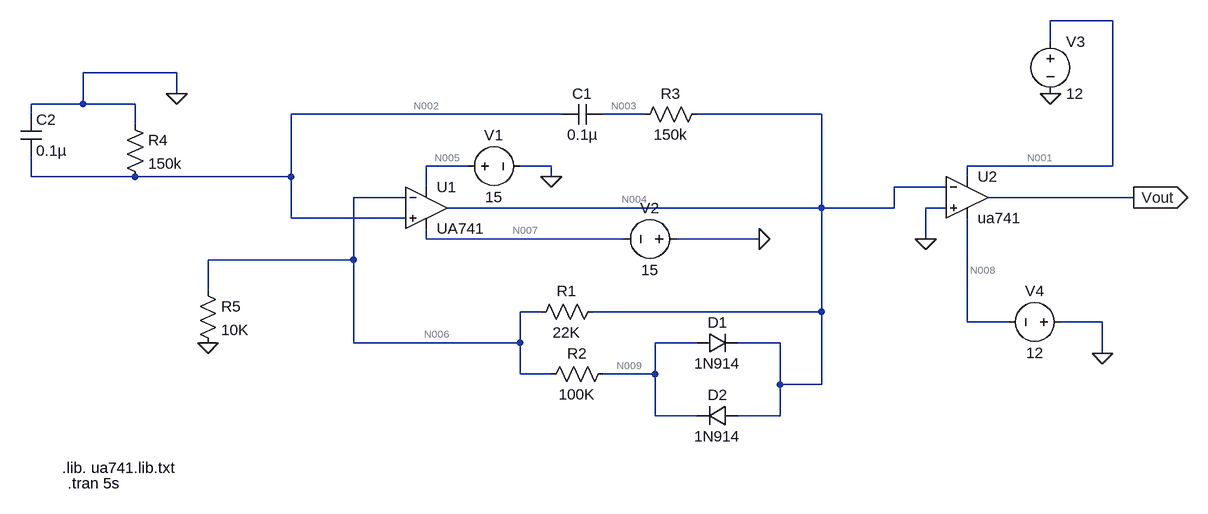
[diagram p0: schematic wien_bridgesine_to_square[1].asc]
wien_bridgesine_to_square[1].asc, the LTspice schematic file:
Version 4
SHEET 1 1880 680
WIRE 1296 -144 1200 -144
WIRE 1200 -112 1200 -144
WIRE -144 -64 -288 -64
WIRE -144 -32 -144 -64
WIRE -288 -16 -288 -64
WIRE -288 -16 -368 -16
WIRE -208 -16 -288 -16
WIRE -368 0 -368 -16
WIRE 448 0 32 0
WIRE 576 0 512 0
WIRE 848 0 656 0
WIRE -208 16 -208 -16
WIRE 304 80 240 80
WIRE 432 80 384 80
WIRE 1296 80 1296 -144
WIRE 1296 80 1072 80
WIRE -368 96 -368 64
WIRE -208 96 -368 96
WIRE 32 96 32 0
WIRE 32 96 -208 96
WIRE 432 96 432 80
WIRE 1072 96 1072 80
WIRE 240 112 240 80
WIRE 1040 112 960 112
WIRE 208 128 128 128
WIRE 1328 128 1104 128
WIRE 848 144 848 0
WIRE 848 144 272 144
WIRE 960 144 960 112
WIRE 960 144 848 144
WIRE 1040 144 1008 144
WIRE 32 160 32 96
WIRE 208 160 32 160
WIRE 240 192 240 176
WIRE 544 192 240 192
WIRE 752 192 624 192
WIRE 1008 192 1008 144
WIRE 128 224 128 128
WIRE 128 224 -96 224
WIRE -96 272 -96 224
WIRE 416 304 384 304
WIRE 848 304 848 144
WIRE 848 304 496 304
WIRE 1072 320 1072 160
WIRE 1136 320 1072 320
WIRE 1280 320 1216 320
WIRE 128 352 128 224
WIRE 384 352 384 304
WIRE 384 352 128 352
WIRE 656 352 592 352
WIRE 784 352 720 352
WIRE 1280 368 1280 320
WIRE 384 400 384 352
WIRE 432 400 384 400
WIRE 592 400 592 352
WIRE 592 400 512 400
WIRE 784 416 784 352
WIRE 848 416 848 304
WIRE 848 416 784 416
WIRE 592 464 592 400
WIRE 656 464 592 464
WIRE 784 464 784 416
WIRE 784 464 720 464
FLAG -144 -32 0
FLAG -96 352 0
FLAG 432 96 0
FLAG 752 192 0
FLAG 1200 -32 0
FLAG 1280 368 0
FLAG 1008 192 0
FLAG 1328 128 Vout
IOPIN 1328 128 Out
SYMBOL OpAmps\\opamp2 240 80 R0
SYMATTR InstName U1
SYMATTR Value UA741
SYMBOL res 512 288 R90
WINDOW 0 0 56 VBottom 2
WINDOW 3 32 56 VTop 2
SYMATTR InstName R1
SYMATTR Value 22K
SYMBOL res 528 384 R90
WINDOW 0 0 56 VBottom 2
WINDOW 3 32 56 VTop 2
SYMATTR InstName R2
SYMATTR Value 100K
SYMBOL diode 656 368 R270
WINDOW 0 32 32 VTop 2
WINDOW 3 0 32 VBottom 2
SYMATTR InstName D1
SYMATTR Value 1N914
SYMBOL diode 720 448 R90
WINDOW 0 0 32 VBottom 2
WINDOW 3 32 32 VTop 2
SYMATTR InstName D2
SYMATTR Value 1N914
SYMBOL res 672 -16 R90
WINDOW 0 0 56 VBottom 2
WINDOW 3 32 56 VTop 2
SYMATTR InstName R3
SYMATTR Value 150k
SYMBOL cap 512 -16 R90
WINDOW 0 0 32 VBottom 2
WINDOW 3 32 32 VTop 2
SYMATTR InstName C1
SYMATTR Value 0.1µ
SYMBOL cap -384 0 R0
SYMATTR InstName C2
SYMATTR Value 0.1µ
SYMBOL res -224 0 R0
SYMATTR InstName R4
SYMATTR Value 150k
SYMBOL res -112 256 R0
SYMATTR InstName R5
SYMATTR Value 10K
SYMBOL voltage 288 80 R270
WINDOW 0 32 56 VTop 2
WINDOW 3 -32 56 VBottom 2
WINDOW 123 0 0 Left 0
WINDOW 39 0 0 Left 0
SYMATTR InstName V1
SYMATTR Value 15
SYMBOL voltage 640 192 R90
WINDOW 0 -32 56 VBottom 2
WINDOW 3 32 56 VTop 2
WINDOW 123 0 0 Left 0
WINDOW 39 0 0 Left 0
SYMATTR InstName V2
SYMATTR Value 15
SYMBOL voltage 1200 -128 R0
WINDOW 123 0 0 Left 0
WINDOW 39 0 0 Left 0
SYMATTR InstName V3
SYMATTR Value 12
SYMBOL OpAmps\\ua741 1072 64 R0
SYMATTR InstName U2
SYMBOL voltage 1232 320 R90
WINDOW 0 -32 56 VBottom 2
WINDOW 3 32 56 VTop 2
SYMATTR InstName V4
SYMATTR Value 12
TEXT -320 544 Left 2 !.lib. ua741.lib.txt
TEXT -312 568 Left 2 !.tran 5s

The netlist it stands for:
* wien_bridgesine_to_square[1].asc
XU1 N002 N006 N005 N007 N004 UA741  ; pins In+ In- V+ V- OUT
R1 N004 N006 22K
R2 N009 N006 100K
D1 N009 N004 1N914
D2 N004 N009 1N914
R3 N004 N003 150k
C1 N003 N002 0.1µ
C2 0 N002 0.1µ
R4 0 N002 150k
R5 N006 0 10K
V1 N005 0 15
V2 0 N007 15
V3 N001 0 12
XU2 0 N004 N001 N008 Vout ua741  ; pins In+ In- V+ V- OUT
V4 0 N008 12
.model D D
.lib standard.dio
.lib. ua741.lib.txt
.tran 5s
.backanno
.end

* Results of the author's LTspice run, read from the files saved beside the schematic
* Operating Point, zero values left out:
*   V(n004) = -36.38 mV
*   V(n007) = -15 V
*   V(n005) = 15 V
*   V(n006) = -11.94 mV
*   V(n002) = -11.96 mV
*   V(n009) = -12.22 mV
*   V(n003) = -36.38 mV
*   V(n001) = 12 V
*   V(vout) = 11.6 V
*   V(n008) = -12 V
*   I(D2) = -1.042 nA
*   I(D1) = 1.775 nA
*   I(R5) = -1.194 µA
*   I(R4) = 79.72 nA
*   I(R2) = -2.817 nA
*   I(R1) = -1.111 µA
*   I(V4) = -1.337 mA
*   I(V3) = -1.33 mA
*   I(V2) = -1.667 mA
*   I(V1) = -1.667 mA
*   Ix(u1:1) = 79.72 nA
*   Ix(u1:2) = 79.76 nA
*   Ix(u1:3) = 1.667 mA
*   Ix(u1:4) = -1.667 mA
*   Ix(u1:5) = 1.069 µA
*   Ix(u2:1) = 114.6 nA
*   Ix(u2:2) = 44.87 nA
*   Ix(u2:3) = 1.33 mA
*   Ix(u2:4) = -1.337 mA
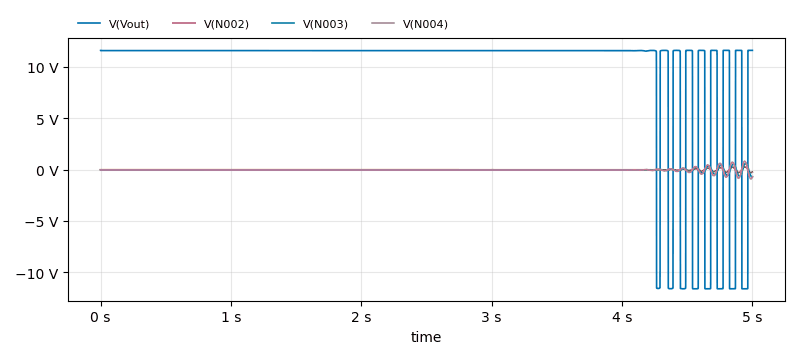
[diagram p1: Transient Analysis of wien_bridgesine_to_square[1].asc, plotted from the saved traces]
* Transient Analysis, 1 run:
*   V(Vout): min -11.61 V, max 11.61 V, average 10.04 V, rms 11.59 V, last 11.61 V
*   V(N002): min -306.5 mV, max 272.3 mV, average -12.55 mV, rms 50.4 mV, last -231.7 mV
*   V(N003): min -697.7 mV, max 601.2 mV, average -36.73 mV, rms 115.8 mV, last -695.7 mV
*   V(N004): min -915.3 mV, max 820.6 mV, average -37.97 mV, rms 154 mV, last -701.4 mV